# Altium schematic sheet Лист 2.SchDoc
size 420 x 297 mm; Scale: 1:1; Обозначение документа: АЛ.001.001 Э3; Номер листа: 2; Разраб.: Иванов; Пров.: Петров; Утв.: Сидоров; Наименование организации: ОАО "Ваша фирма"; Перв. применение: АБВГ.123456.000; Наименование изделия 1: Плата; Наименование изделия 2: Схема электрическая; Наименование изделия 3: принципиальная; Нач. отд.: Нач. отд.; Фамилия нач. отд.: Сидоров
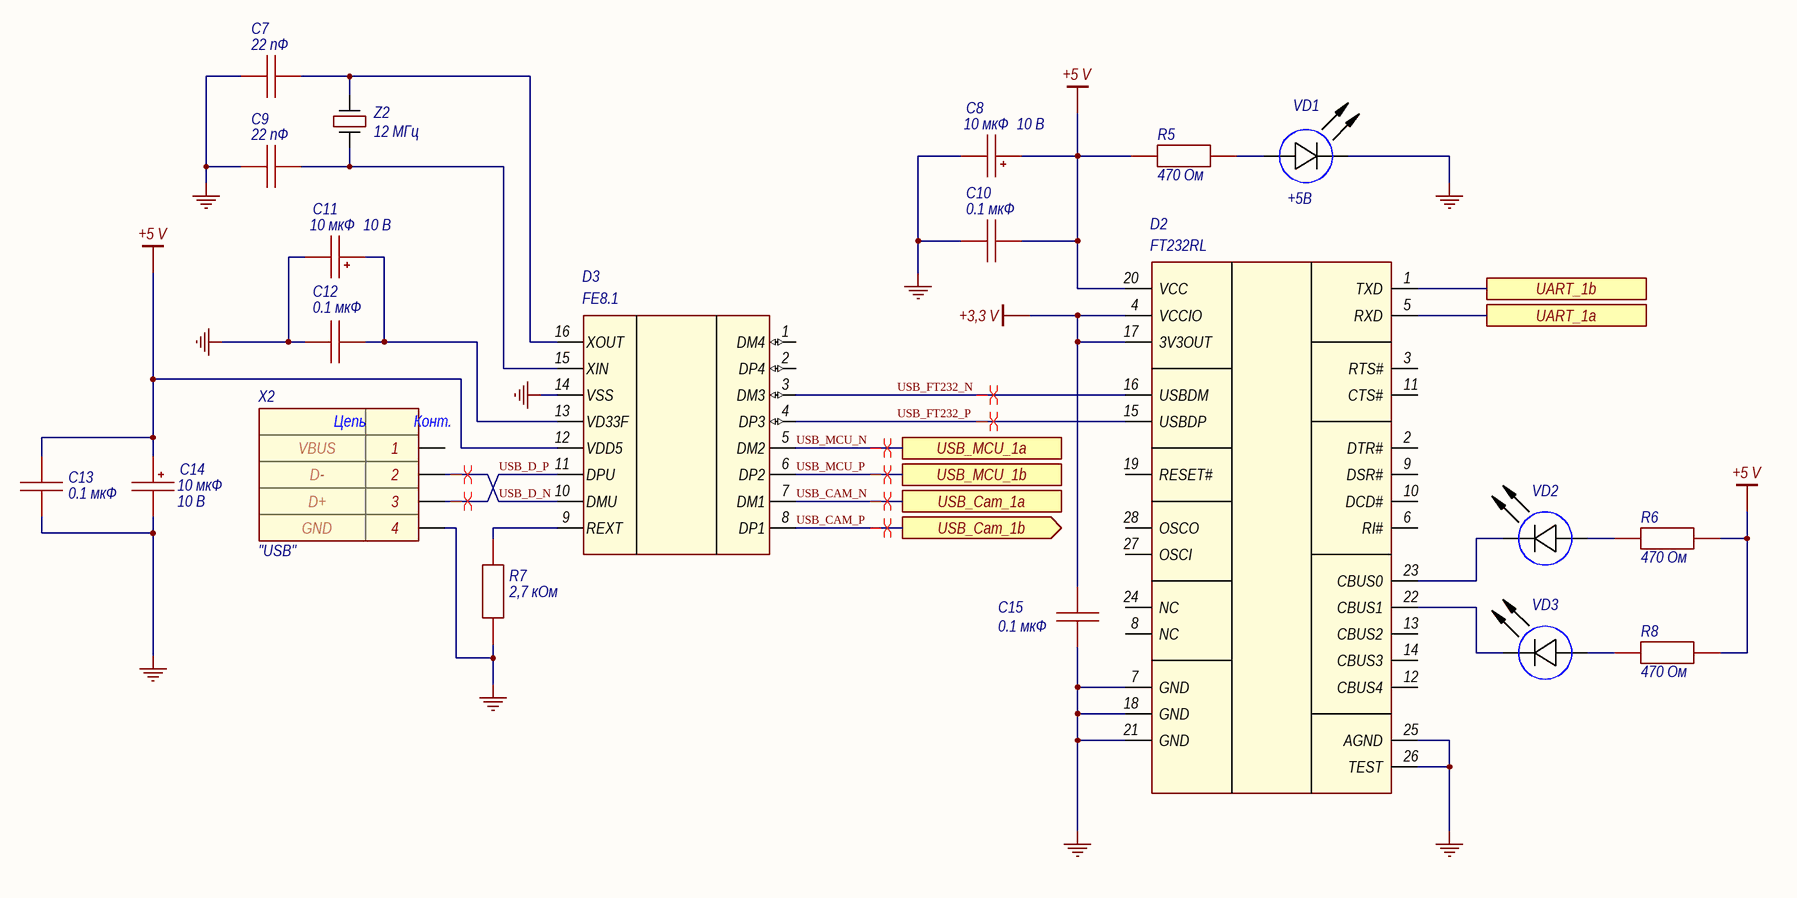
[diagram p0: Лист 2.SchDoc]

## Parts
C7  value 22 пФ  [CAP: 0805]
C8  value 10 мкФ  Voltage: 10 В  [CAP: TANTAL-A]
C9  value 22 пФ  [CAP: 0805]
C10  value 0.1 мкФ  [CAP: 0805]
C11  value 10 мкФ  Voltage: 10 В  [CAP: TANTAL-A]
C12  value 0.1 мкФ  [CAP: 0805]
C13  value 0.1 мкФ  [CAP: 0805]
C14  value 10 мкФ  Voltage: 10 В  [CAP: TANTAL-A]
C15  value 0.1 мкФ  [CAP: 0805]
D2  FT232RL  [28-SSOP]
D3  FE8.1  [16-SSOP]
R5  value 470 Ом  [RES: 0805]  (hidden comment: 2,7 кОм)
R6  value 470 Ом  [RES: 0805]  (hidden comment: 2,7 кОм)
R7  2,7 кОм  [RES: 0805]
R8  value 470 Ом  [RES: 0805]  (hidden comment: 2,7 кОм)
VD1  +5В  [LED: 0805G]
VD2  (no value)  [LED: 0805G]
VD3  (no value)  [LED: 0805G]
X2  "USB"  [CON: USB type B]
Z2  12 МГц  [OSC: 5032 2 pin]

## Ports
UART_1a, UART_1b, USB_Cam_1a, USB_Cam_1b (out), USB_MCU_1a, USB_MCU_1b

## Nets
+3,3 V: C15.2 D2.4(VCCIO) D2.17(3V3OUT)
+5 V: C8.1 C10.1 C13.2 C14.1 D2.20(VCC) D3.12(VDD5) R5.2 R6.1 R8.1
GND: C7.1 C8.2 C9.1 C10.2 C11.2 C12.2 C13.1 C14.2 C15.1 D2.7(GND) D2.18(GND) D2.21(GND) D2.25(AGND) D2.26(TEST) D3.14(VSS) R7.2 VD1.2(C) X2.4
UART_1a: D2.5(RXD) ; port UART_1a
UART_1b: D2.1(TXD) ; port UART_1b
USB_CAM_N: D3.7(DM1) ; port USB_Cam_1a
USB_CAM_P: D3.8(DP1) ; port USB_Cam_1b
USB_D_N: D3.10(DMU) X2.2
USB_D_P: D3.11(DPU) X2.3
USB_FT232_N: D2.16(USBDM) D3.3(DM3)
USB_FT232_P: D2.15(USBDP) D3.4(DP3)
USB_MCU_N: D3.5(DM2) ; port USB_MCU_1a
USB_MCU_P: D3.6(DP2) ; port USB_MCU_1b
NetC7_2: C7.2 D3.16(XOUT) Z2.1
NetC9_2: C9.2 D3.15(XIN) Z2.2
NetC11_1: C11.1 C12.1 D3.13(VD33F)
NetD2_22: D2.22(CBUS1) VD3.2(C)
NetD2_23: D2.23(CBUS0) VD2.2(C)
NetD3_9: D3.9(REXT) R7.1
NetR5_1: R5.1 VD1.1(A)
NetR6_2: R6.2 VD2.1(A)
NetR8_2: R8.2 VD3.1(A)

Not connected (* = marked no-connect by the designer): D2 2(DTR#) 3(RTS#) 6(RI#) 8(NC) 9(DSR#) 10(DCD#) 11(CTS#) 12(CBUS4) 13(CBUS2) 14(CBUS3) 19(RESET#) 24(NC) 27(OSCI) 28(OSCO); D3 1(DM4) 2(DP4); X2 1

## Layout directives
differential pair: USB_CAM_N, USB_CAM_P, USB_D_N, USB_D_P, USB_FT232_N, USB_FT232_P, USB_MCU_N, USB_MCU_P

## Notes on the sheet
- Подп. и дата
- Инв. № дубл.
- Взам. инв. №
- Инв. № подл.
- Изм.
- Лист
- № докум.
- Подп.
- Дата
- Копировал
- Формат А3
- (in symbol Connector_USB_B) Цепь; Конт.

## Library data of the parts
C7 C9 = Ceramic_0805: Manufacturer: Yageo; PartNumber: CC0805KRX7R7BB104; ValueManufacturerPartNumber: Ceramic capacitor, 22 пФ, X7R, ±10%, 16V, 0805, -55...+125°C; TypeCapacitor: Ceramic capacitor; Tolerance: ±10%; TypeDielectric: X7R; Voltage: 16V; Package: 0805; HelpURL: https://www.digikey.com/product-detail/en/yageo/CC0805KRX7R7BB104/311-1142-1-ND/303052; Temperature: -55...+125°C
C8 C11 C14 = Tantal_A: Manufacturer: AVX; PartNumber: F930J107KAAAJ6; ValueManufacturerPartNumber: Tantalum capacitor, 10 мкФ, 10 В, ±10%, 2Ohm, case A (3216), -55...+125°C; Impedance: 2Ohm; Tolerance: ±10%; TypeDielectric: X7R; TypeCapacitor: Tantalum capacitor; Package: case A (3216); HelpURL: https://www.digikey.com/product-detail/en/avx-corporation/F930J107KAAAJ6/478-12404-1-ND/9645231; Temperature: -55...+125°C
C10 C12 C13 C15 = Ceramic_0805: Manufacturer: Yageo; PartNumber: CC0805KRX7R7BB104; ValueManufacturerPartNumber: Ceramic capacitor, 0.1 мкФ, X7R, ±10%, 16V, 0805, -55...+125°C; TypeCapacitor: Ceramic capacitor; Tolerance: ±10%; TypeDielectric: X7R; Voltage: 16V; Package: 0805; HelpURL: https://www.digikey.com/product-detail/en/yageo/CC0805KRX7R7BB104/311-1142-1-ND/303052; Temperature: -55...+125°C
D2 = FT232RL: USB-UART
R5 R6 R8 = Resistor_0805: Manufacturer: Yageo; PartNumber: RC0805JR-07100RL; ValueManufacturerPartNumber: Resistor film, 470 Ом, ±5%, 0805, 0.125W, -55...+125°C; TypeResistor: Resistor film; Power: 0.125W; Tolerance: ±5%; Package: 0805; HelpURL: https://www.digikey.com/product-detail/en/yageo/RC0805JR-07100RL/311-100ARCT-ND/731185; Temperature: -55...+125°C
R7 = Resistor_0805: Manufacturer: Yageo; PartNumber: RC0805JR-07100RL; ValueManufacturerPartNumber: Resistor film, 2,7 кОм, ±5%, 0805, 0.125W, -55...+125°C; TypeResistor: Resistor film; Power: 0.125W; Tolerance: ±5%; Package: 0805; HelpURL: https://www.digikey.com/product-detail/en/yageo/RC0805JR-07100RL/311-100ARCT-ND/731185; Temperature: -55...+125°C; Value: 2,7 кОм
VD1-VD3 = LED_single: ValueManufacturerPartNumber: LED, *, *, *, -55...+150°C; TypeDiode: LED; Color: GREEN; Manufacturer: *; Package: *; HelpURL: *; Temperature: -55...+150°C; Current: *; VoltageDrop: *; PartNumber: *
X2 = Connector_USB_B: Pin1: VBUS; Pin2: D-; Pin3: D+; Pin4: GND
Z2 = Crystal_5032_2_pin: NX5032GA-8MHz,                8 МГц,                                 30/20ppm,                        8пФ,                                 -40...+85°C,                SMD 5.0*3.2*1.3мм; Frequency: 8; Package: Case 5032